# Altium project Controller.PrjPcb (part 1 of 4)
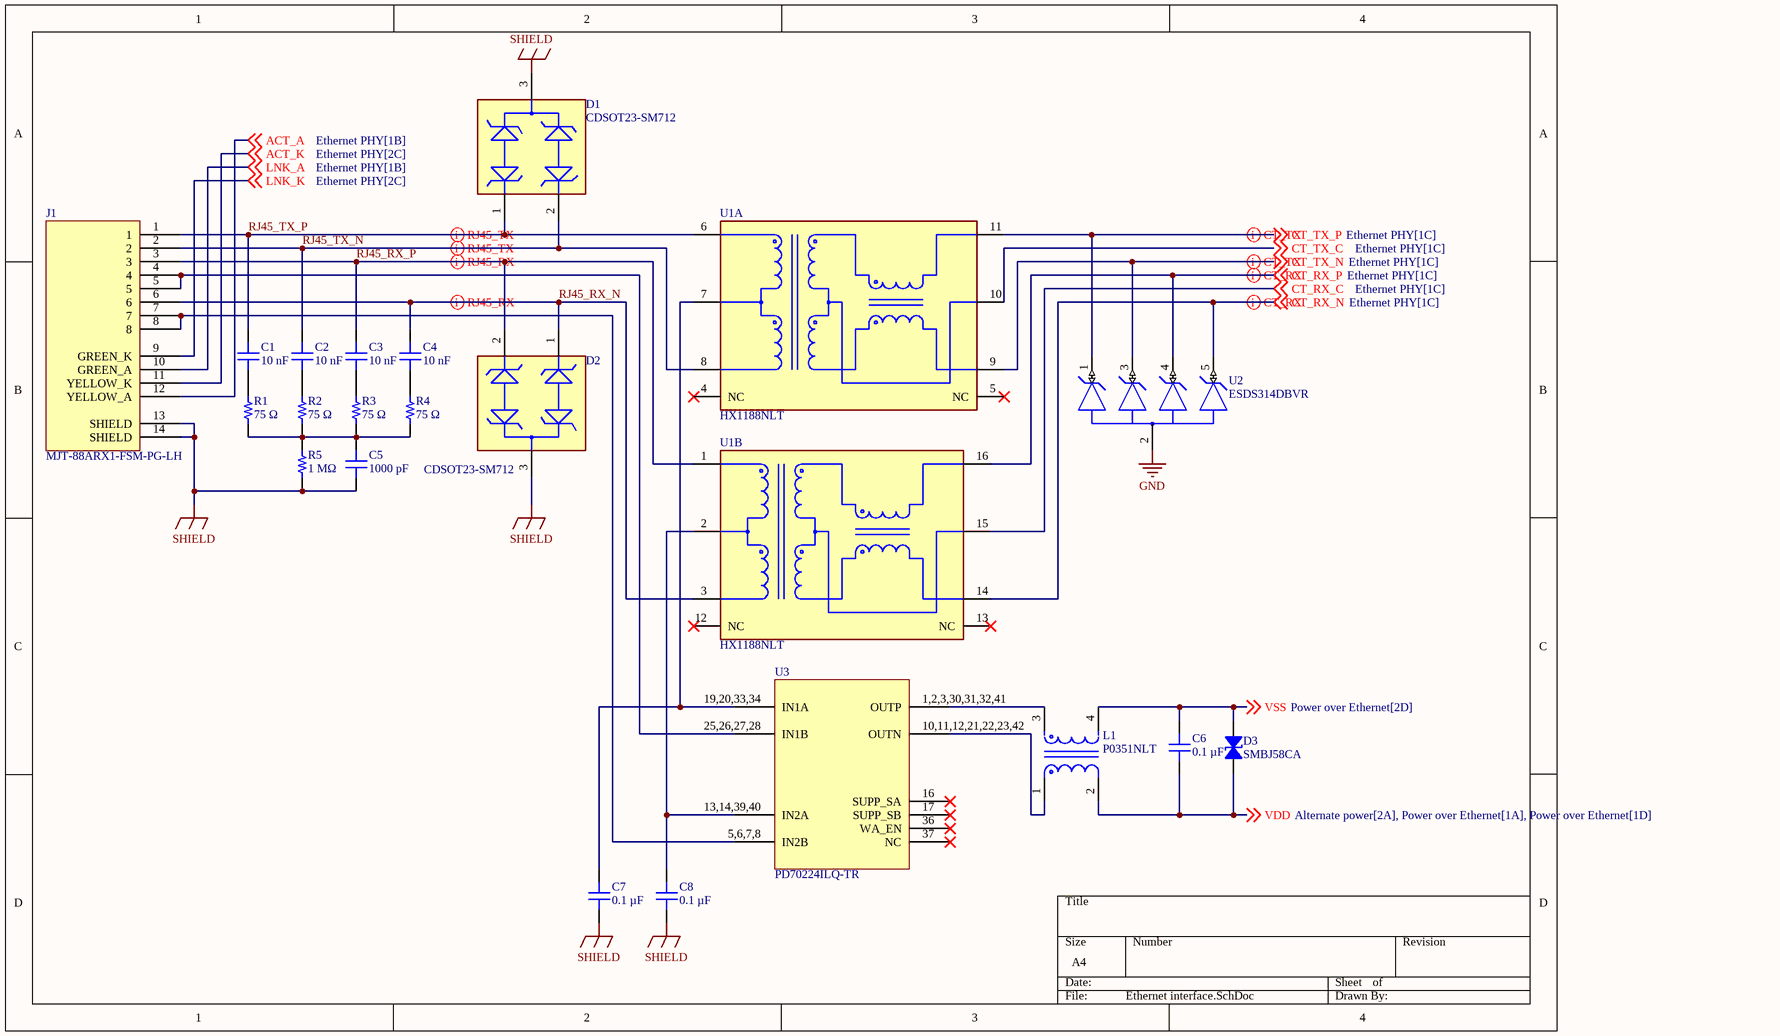
[diagram p0: Ethernet interface.SchDoc]
8 sheets, 217 parts. Net scope: global (net labels, ports and power ports of the same name join across sheets).
Board file: Controller_v1.PcbDoc
Sheets:
  Ethernet interface.SchDoc
  Power over Ethernet.SchDoc
  Power adapter.SchDoc
  Alternate power.SchDoc
  Ethernet PHY.SchDoc
  USB to UART controller.SchDoc
  CPU.SchDoc
  Periphery.SchDoc

## Sheet Ethernet interface.SchDoc
size A4; SheetNumber: 1; SheetTotal: 8

### Parts
C1  Capacitance: 10 nF  [CAP 0805_2012]  (hidden comment: 10000 pF)
C2  Capacitance: 10 nF  [CAP 0805_2012]  (hidden comment: 10000 pF)
C3  Capacitance: 10 nF  [CAP 0805_2012]  (hidden comment: 10000 pF)
C4  Capacitance: 10 nF  [CAP 0805_2012]  (hidden comment: 10000 pF)
C5  1000 pF  [CAP 1210_3225 - 1MM]
C6  0.1 µF  [CAP 0603_1608]
C7  0.1 µF  [CAP 0603_1608]
C8  0.1 µF  [CAP 0603_1608]
D1  CDSOT23-SM712  [FP-SOT23-MFG]
D2  CDSOT23-SM712  [FP-SOT23-MFG]
D3  SMBJ58CA  [DO214AA SMB]
J1  MJT-88ARX1-FSM-PG-LH  [MTJ88ARX1FSMPGLG]
L1  P0351NLT  [FP-P0351NLT-MFG]
R1  75 Ω  [RES 0805_2012]
R2  75 Ω  [RES 0805_2012]
R3  75 Ω  [RES 0805_2012]
R4  75 Ω  [RES 0805_2012]
R5  1 MΩ  [RES 0805_2012]
U1  HX1188NLT  [FP-HX1188NLT-MFG]  (parts A,B of 2)
U2  ESDS314DBVR  [FP-DBV0005A-IPC_A]
U3  PD70224ILQ-TR  [PD70224ILQTR]

### Nets
GND: U2.2(GND)  [project net +12V]
SHIELD: C5.1 C7.1 C8.1 D1.3 D2.3 J1.13(SHIELD) J1.14(SHIELD) R5.1
ACT_A: J1.12(YELLOW_A) ; off-sheet ACT_A
ACT_K: J1.11(YELLOW_K) ; off-sheet ACT_K
CT_RX_C: U1.15(CMT) ; off-sheet CT_RX_C
CT_RX_N: U1.14(TX-) U2.5(I/O4) ; off-sheet CT_RX_N
CT_RX_P: U1.16(TX+) U2.4(I/O3) ; off-sheet CT_RX_P
CT_TX_C: U1.10(CMT) ; off-sheet CT_TX_C
CT_TX_N: U1.9(RX-) U2.3(I/O2) ; off-sheet CT_TX_N
CT_TX_P: U1.11(RX+) U2.1(I/O1) ; off-sheet CT_TX_P
LNK_A: J1.10(GREEN_A) ; off-sheet LNK_A
LNK_K: J1.9(GREEN_K) ; off-sheet LNK_K
RJ45_RX_N: C4.2 D2.1 J1.6 U1.3(TD-)
RJ45_RX_P: C3.2 D2.2 J1.3 U1.1(TD+)
RJ45_TX_N: C2.2 D1.2 J1.2 U1.8(RD-)
RJ45_TX_P: C1.2 D1.1 J1.1 U1.6(RD+)
VDD: C6.1 D3.1 L1.2 ; off-sheet VDD
VSS: C6.2 D3.2 L1.4 ; off-sheet VSS
NetC1_1: C1.1 R1.2
NetC2_1: C2.1 R2.2
NetC3_1: C3.1 R3.2
NetC4_1: C4.1 R4.2
NetC5_2: C5.2 R1.1 R2.1 R3.1 R4.1 R5.2
NetC7_2: C7.2 U1.7(RCT) U3.19,20,33,34(IN1A)
NetC8_2: C8.2 U1.2(TCT) U3.13,14,39,40(IN2A)
NetJ1_4: J1.4 J1.5 U3.25,26,27,28(IN1B)
NetJ1_7: J1.7 J1.8 U3.5,6,7,8(IN2B)
NetL1_1: L1.1 U3.10,11,12,21,22,23,42(OUTN)
NetL1_3: L1.3 U3.1,2,3,30,31,32,41(OUTP)

Not connected (* = marked no-connect by the designer): U1 4(NC)* 5(NC)* 12(NC)* 13(NC)*; U3 16(SUPP_SA)* 17(SUPP_SB)* 36(WA_EN)* 37(NC)*

### Layout directives
differential pair: CT_RX_N, CT_RX_P, CT_TX_N, CT_TX_P, RJ45_RX_N, RJ45_RX_P, RJ45_TX_N, RJ45_TX_P

### Library data of the parts
C1-C4 = GRM2165C2A103JA01D: CAP CER 10000PF 100V C0GNP0 0805; manufacturer: Murata Electronics; Temperature Coefficient: C0G, NP0; Tolerance: ±5%; Part Number: GRM2165C2A103JA01D; Applications: General Purpose; componentlink1description: Datasheet; componentlink1url: https://search.murata.co.jp/Ceramy/image/img/A01X/G101/ENG/GRM2165C2A103JA01-01A.pdf; componentlink2description: DigiKey Link; componentlink2url: https://www.digikey.com/en/products/detail/murata-electronics/GRM2165C2A103JA01D/13904864; Device Package: 0805 (2012 Metric); lastupdated: 9.02.2024 20:14:44; Lifecycle Status: Active; Minimum Order: 1; Mounting Type: Surface Mount, MLCC; Operating Temperature: -55°C ~ 125°C; Package / Case: 0805 (2012 Metric); packaging: TapeAndReel; partid: 48723; Part Status: Active; price: 0.02; series: GRM; Size / Dimension: 0.079" L x 0.049" W (2.00mm x 1.25mm); Supplier 1: DigiKey; Supplier Part Number 1: 490-GRM2165C2A103JA01DCT-ND; Thickness (Max): 0.026" (0.65mm); value: 10000 pF; Voltage - Rated: 100V
C5 = KGM32LCG3D102JU: CAP CER 1000PF 2KV C0G/NP0 1210; manufacturer: KYOCERA AVX; Temperature Coefficient: C0G, NP0; Tolerance: ±5%; Voltage - Rated: 2000V (2kV); Part Number: KGM32LCG3D102JU; Value: 1000 pF; Applications: General Purpose; Capacitance: 1000 pF; componentlink1description: Datasheet; componentlink1url: https://datasheets.kyocera-avx.com/HVKGM.pdf; componentlink2description: DigiKey Link; componentlink2url: https://www.digikey.com/en/products/detail/kyocera-avx/KGM32LCG3D102JU/11249117; Device Package: 1210 (3225 Metric); Features: High Voltage; lastupdated: 4.06.2024 19:20:42; Lifecycle Status: Active; Minimum Order: 1; Mounting Type: Surface Mount, MLCC; Operating Temperature: -55°C ~ 125°C; Package / Case: 1210 (3225 Metric); packaging: TapeAndReel; partid: 58470; price: 0.32; series: KGM - HV; Size / Dimension: 0.130" L x 0.098" W (3.30mm x 2.50mm); Supplier 1: DigiKey; Supplier Part Number 1: 478-KGM32LCG3D102JUCT-ND; Thickness (Max): 0.110" (2.80mm)
C6-C8 = C1608X7R1H104K080AE: CAP CER 0.1UF 50V X7R 0603; manufacturer: TDK Corporation; Tolerance: ±10%; Part Number: C1608X7R1H104K080AE; Capacitance: 0.1 µF; Applications: Boardflex Sensitive; componentlink1description: Datasheet; componentlink1url: https://product.tdk.com/info/en/catalog/datasheets/mlcc_commercial_soft_en.pdf?ref_disty=digikey; componentlink2description: DigiKey Link; componentlink2url: https://www.digikey.com/en/products/detail/tdk-corporation/C1608X7R1H104K080AE/4490564; Device Package: 0603 (1608 Metric); Features: Soft Termination; lastupdated: 9.02.2024 20:10:17; Lifecycle Status: Active; Minimum Order: 1; Mounting Type: Surface Mount, MLCC; Operating Temperature: -55°C ~ 125°C; Package / Case: 0603 (1608 Metric); packaging: TapeAndReel; partid: 12789; Part Status: Active; price: 0.02; series: C; Size / Dimension: 0.063" L x 0.031" W (1.60mm x 0.80mm); Supplier 1: DigiKey; Supplier Part Number 1: 445-15927-6-ND; Temperature Coefficient: X7R; Thickness (Max): 0.037" (0.95mm); value: 0.1 µF; Voltage - Rated: 50V
D1 D2 = CMP-2000-05081-2: TVS DIODE 7V/12V 14V/26V SOT23-3; Manufacturer: Bourns Inc.; Peak Pulse Current: 17A; Standoff Height: 0.05mm; Breakdown Voltage: 7.5V; Direction: Bidirectional; Clamping Voltage: 26V; Value: 75pF; Number Of Channels: 2; Reverse Standoff Voltage: 12V; Peak Pulse Power: 400W; Temperature Range Low: -55°C; Mouser Description: Transient Voltage Suppressor, TVS, CDSOT23 Series, Unidirectional, 12 V, SOT-23, 3, 13.3 V; Device Class L3: unset; Package: SOT23; Height: 1.17mm; RoHS: TRUE; Octopart: https://octopart.com/cdsot23-sm712-bourns-7576327; Category: Diode; Ipc Land Pattern Name: SOT95P229X103-3; ComponentLink2URL: https://www.bourns.com/docs/Product-Datasheets/CDSOT23-SM712.pdf; Temperature Range High: +150°C; ComponentLink2Description: Datasheet; Digikey Description: TVS DIODE 7V/12V 14V/26V SOT23-3; Manufacturer Part Number: CDSOT23-SM712; Temperature: -55°C to +150°C; Device Class L2: TVS Diodes; Lead Free: Yes; Device Class L1: Circuit Protection; Automotive: No; Capacitance: 75pF
D3 = SMBJ58CA: TVS DIODE 58VWM 93.6VC DO214AA; Part Number: SMBJ58CA; Supplier 1: DigiKey; Supplier Part Number 1: SMBJ58CABCT-ND
J1 = MTJ-88ARX1-FSM-PG-LH: Supplier 1: TME; Supplier Part Number 1: MTJ88ARX1FSMPGLH
L1 = CMP-16296-000003-1: COMMON MODE CHOKE 2.8A 2LN SMD; Shielding: Unshielded; Tolerance: 35%; Inductance: 1.47mH; DC Resistance (DCR): 80mR; Number of Lines: 2; Width: 0.67inch; Series: -; Package Quantity: 1; Termination: SMD/SMT; Number of Pins: 50; Min Operating Temperature: -40°C; Radiation Hardening: No; Case/Package: SMD/SMT; Length: 19.56mm; REACH SVHC: No SVHC; Max Operating Temperature: 120°C; Height: 9.91mm; DC Current: 2.8A; Mount: Surface Mount; Packaging: Tape and Reel; Depth: 17.02mm; Current: 2.8A; Military Standard: Not; Max DC Current: 2.8A
R1-R4 = CRCW080575R0FKEA: RES SMD 75 OHM 1% 1/8W 0805; Manufacturer: Vishay Dale; Power (Watts): 0.125W, 1/8W; Resistance: 75 Ohms; Temperature Coefficient: ±100ppm/°C; Part Number: CRCW080575R0FKEA; Value: 75 Ω; ComponentLink1Description: Datasheet; ComponentLink1URL: http://www.vishay.com/docs/20035/dcrcwe3.pdf; ComponentLink2Description: DigiKey Link; ComponentLink2URL: https://www.digikey.com/en/products/detail/vishay-dale/CRCW080575R0FKEA/1175509; Composition: Thick Film; Device Package: 0805 (2012 Metric); Features: Automotive AEC-Q200; Height - Seated (Max): 0.020" (0.50mm); LastUpdated: 8.02.2024 21:02:17; Lifecycle Status: Active; Minimum Order: 1; Number of Terminations: 2; Operating Temperature: -55°C ~ 155°C; Package / Case: 0805 (2012 Metric); Packaging: TapeAndReel; PartId: 32714; Part Status: Active; Price: 0.01; Ratings: AEC-Q200; Series: CRCW; Size / Dimension: 0.079" L x 0.049" W (2.00mm x 1.25mm); Supplier 1: DigiKey; Supplier Part Number 1: 541-75.0CCT-ND; Supplier Device Package: 0805; Tolerance: ±1%
R5 = RCS08051M00FKEA: RES SMD 1M OHM 1% 1/2W 0805; Manufacturer: Vishay Dale; Power (Watts): 0.5W, 1/2W; Temperature Coefficient: ±100ppm/°C; Part Number: RCS08051M00FKEA; Value: 1 MΩ; ComponentLink1Description: Datasheet; ComponentLink1URL: http://www.vishay.com/docs/20065/rcse3.pdf; ComponentLink2Description: DigiKey Link; ComponentLink2URL: https://www.digikey.com/en/products/detail/vishay-dale/RCS08051M00FKEA/5866999; Composition: Thick Film; Device Package: 0805 (2012 Metric); Features: Automotive AEC-Q200, Pulse Withstanding; Height - Seated (Max): 0.020" (0.50mm); LastUpdated: 8.02.2024 21:02:38; Lifecycle Status: Active; Minimum Order: 1; Number of Terminations: 2; Operating Temperature: -55°C ~ 155°C; Package / Case: 0805 (2012 Metric); Packaging: TapeAndReel; PartId: 27791; Part Status: Active; Price: 0.02; Ratings: AEC-Q200; Resistance: 1 MΩ; Series: RCS e3; Size / Dimension: 0.079" L x 0.049" W (2.00mm x 1.25mm); Supplier 1: DigiKey; Supplier Part Number 1: 541-2853-1-ND; Supplier Device Package: 0805; Tolerance: ±1%
U1 = CMP-2000-06432-2: XFRMR MAGNETIC 1PORT 1:1 10/100; DC Resistance (DCR): 1.5R; Insertion Loss: -3dB; Shielding: Unshielded; Return Loss: -12dB; Lead/Base Style: Gull Wing; Isolation Voltage: 1.5kV; Length: 12.7mm; Number of Pins: 16; Depth: 9.65mm; Turns Ratio: 1:1; Max Operating Temperature: 85°C; RoHS Compliant: Yes; Termination: SMD/SMT; Height: 5.97mm; Radiation Hardening: No; Height - Seated (Max): 6.22mm; Width: 7.11mm; Series: -; Packaging: Tape and Reel; Min Operating Temperature: -40°C; Mount: Surface Mount; Package Quantity: 1
U2 = CMP-04985-000014-1: FAMILY OF UNI-DIRECTIONAL SURGE; Peak Pulse Current: 25A; Number of Unidirectional Channels: 4; Power Line Protection: No; Interface: USB; Min Breakdown Voltage: 4.5V; Peak Pulse Power: 170W; Clamping Voltage: 6.5V; Reverse Standoff Voltage: 3.6V; RoHS Compliant: Yes; Packaging: Cut Tape; Resistor Type: Zener; Min Operating Temperature: -40°C; Number of Channels: 4; Case/Package: SOT-23-5; Mount: Surface Mount; Max Operating Temperature: 125°C
U3 = PD70224ILQ-TR: Supplier 1: DigiKey; Supplier Part Number 1: PD70224ILQ-CT-ND